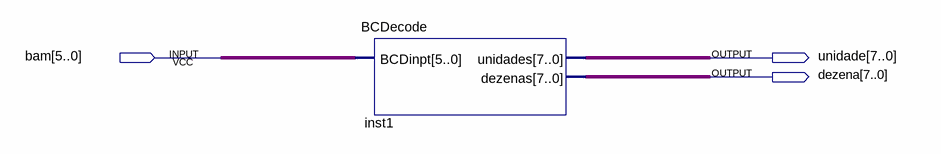
[diagram p0: schematic sheet]
// Quartus schematic testedobcd.bdf as structural Verilog: 1 symbols, 3 pins
module testedobcd (
  input  [5:0] bam,
  output [7:0] unidade,
  output [7:0] dezena
);

  BCDecode inst1 (.BCDinpt(bam), .unidades(unidade), .dezenas(dezena));
endmodule
